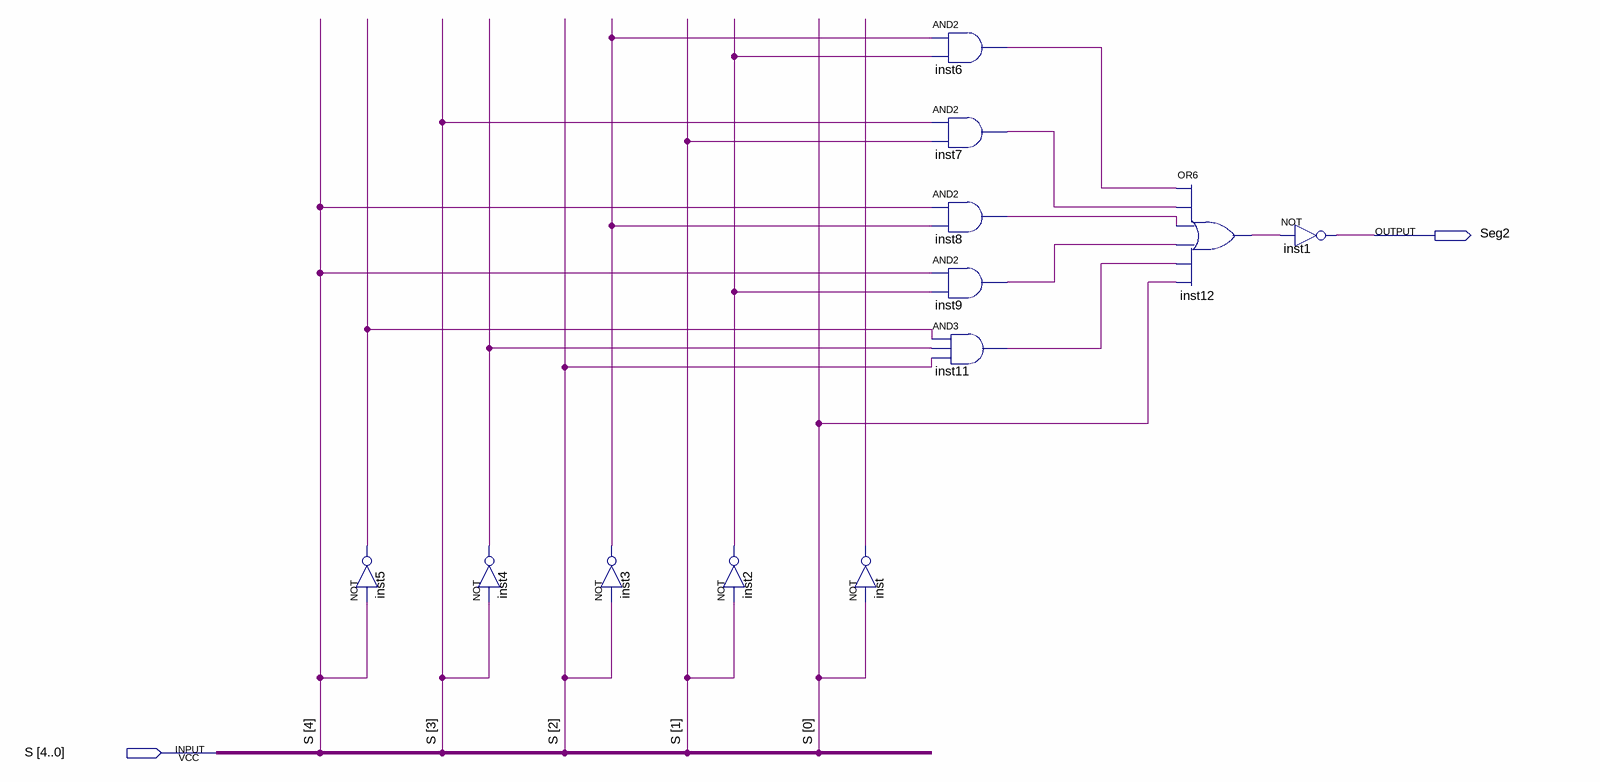
[diagram p0: schematic sheet]
// Quartus schematic Seg2.bdf as structural Verilog: 12 symbols, 2 pins
module Seg2 (
  input  [4:0] S,
  output Seg2
);

  wire inst2_out, inst3_out, inst4_out, inst5_out, inst6_out, inst7_out, inst8_out, inst9_out, inst11_out,
       inst12_out, inst_out;

  not inst5 (inst5_out, S[4]);
  not inst4 (inst4_out, S[3]);
  not inst3 (inst3_out, S[2]);
  not inst2 (inst2_out, S[1]);
  not inst (inst_out, S[0]);
  and inst6 (inst6_out, inst3_out, inst2_out);
  and inst7 (inst7_out, S[3], S[1]);
  and inst8 (inst8_out, S[4], inst3_out);
  and inst9 (inst9_out, S[4], inst2_out);
  and inst11 (inst11_out, inst5_out, inst4_out, S[2]);
  or inst12 (inst12_out, inst6_out, inst7_out, inst8_out, inst9_out, inst11_out, S[0]);
  not inst1 (Seg2, inst12_out);
endmodule
